# EAGLE design switches (EAGLE 4.16)
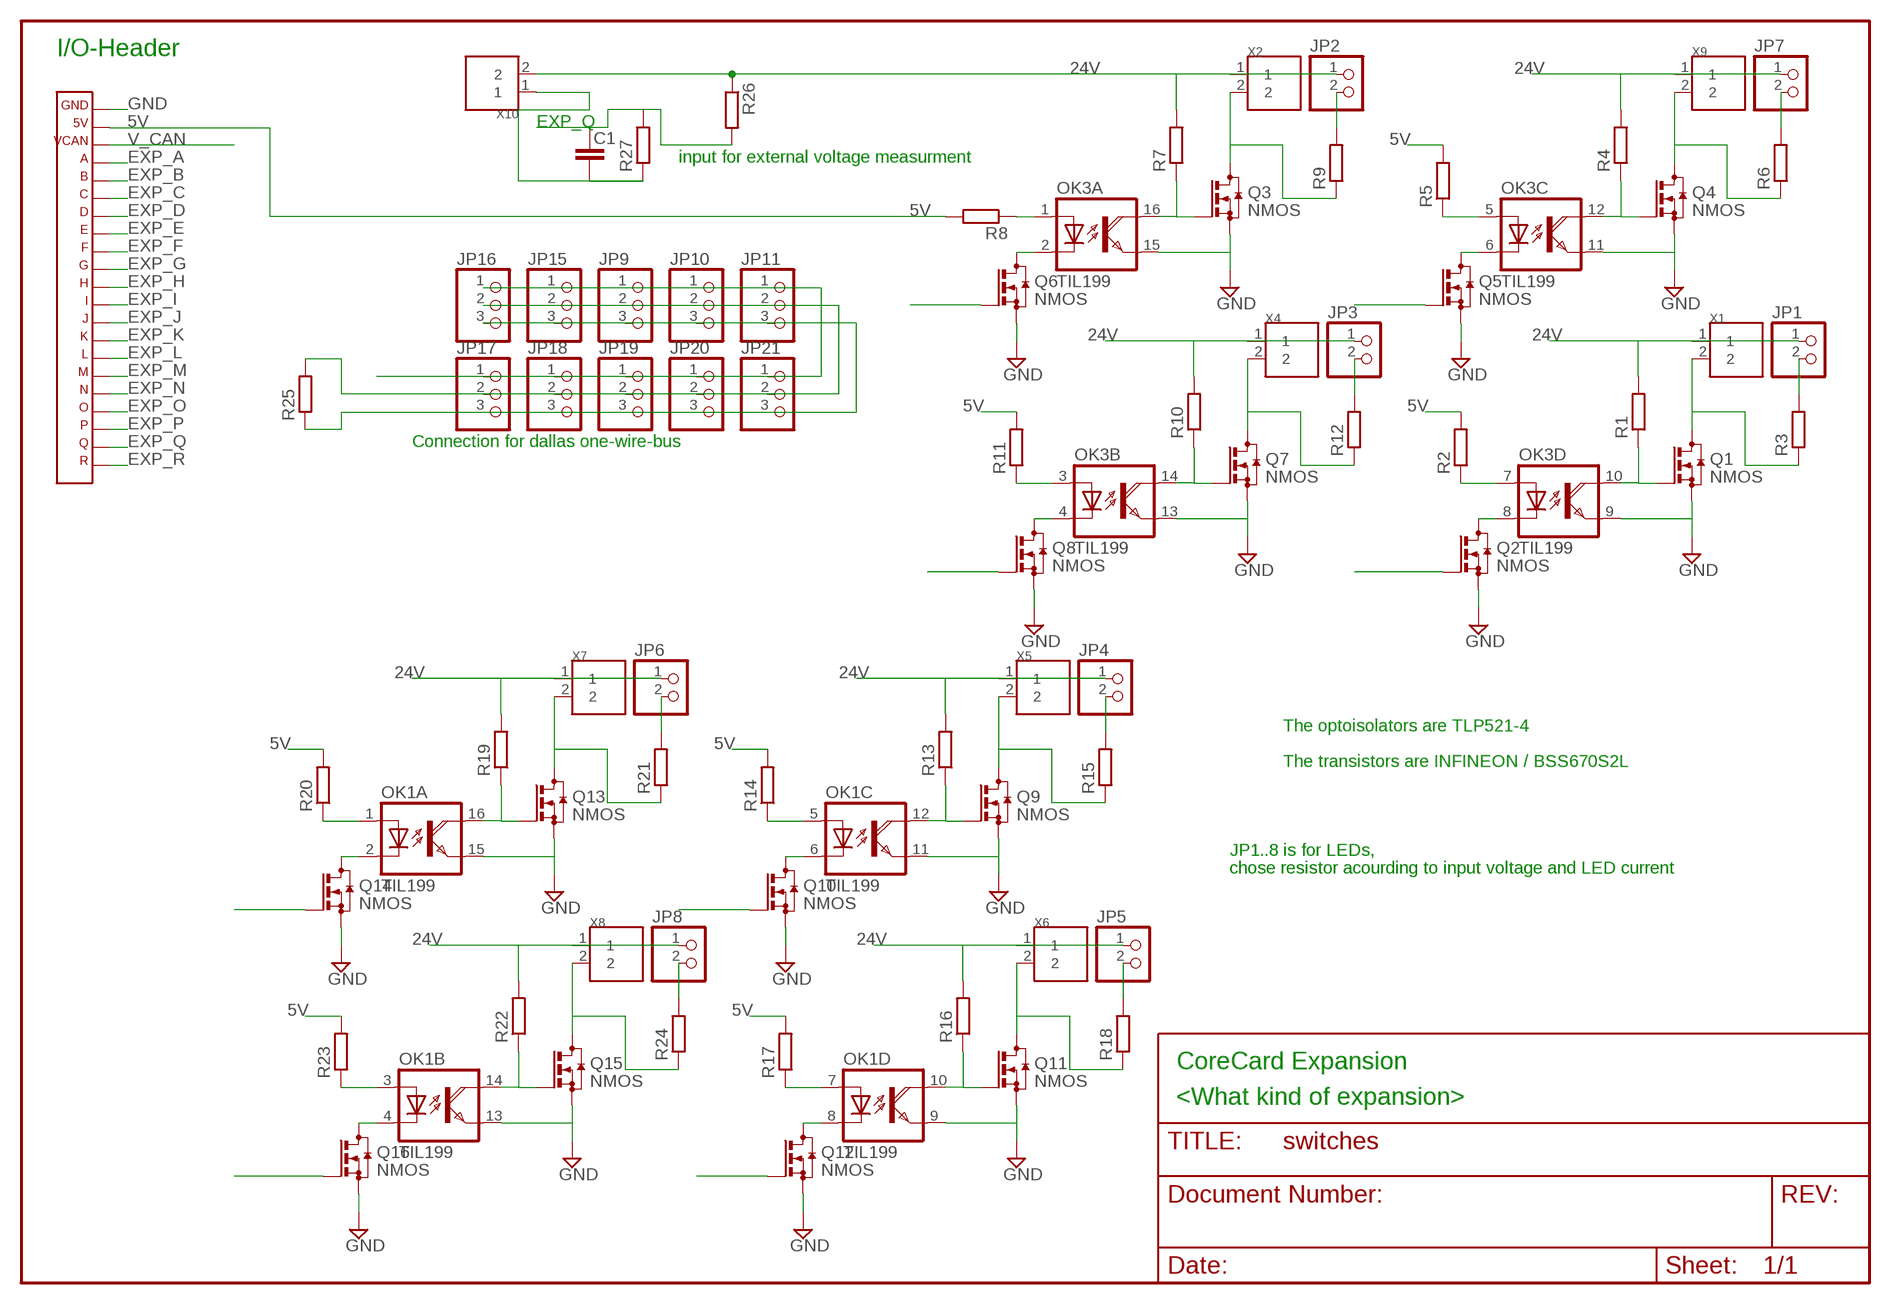
[diagram p0: schematic, sheet 1]

## Parts
C1  C-EUC0603  [C0603]
JP1  PINHD-1X2  [1X02]
JP2  PINHD-1X2  [1X02]
JP3  PINHD-1X2  [1X02]
JP4  PINHD-1X2  [1X02]
JP5  PINHD-1X2  [1X02]
JP6  PINHD-1X2  [1X02]
JP7  PINHD-1X2  [1X02]
JP8  PINHD-1X2  [1X02]
JP9  PINHD-1X3  [1X03]
JP10  PINHD-1X3  [1X03]
JP11  PINHD-1X3  [1X03]
JP15  PINHD-1X3  [1X03]
JP16  PINHD-1X3  [1X03]
JP17  PINHD-1X3  [1X03]
JP18  PINHD-1X3  [1X03]
JP19  PINHD-1X3  [1X03]
JP20  PINHD-1X3  [1X03]
JP21  PINHD-1X3  [1X03]
OK1  TIL199  [DIL16]
OK3  TIL199  [DIL16]
Q1  NMOS  [SOT23]
Q2  NMOS  [SOT23]
Q3  NMOS  [SOT23]
Q4  NMOS  [SOT23]
Q5  NMOS  [SOT23]
Q6  NMOS  [SOT23]
Q7  NMOS  [SOT23]
Q8  NMOS  [SOT23]
Q9  NMOS  [SOT23]
Q10  NMOS  [SOT23]
Q11  NMOS  [SOT23]
Q12  NMOS  [SOT23]
Q13  NMOS  [SOT23]
Q14  NMOS  [SOT23]
Q15  NMOS  [SOT23]
Q16  NMOS  [SOT23]
R1  R-EUR0603  [R0603@1]
R2  R-EUR0603  [R0603@1]
R3  R-EUR0603  [R0603@1]
R4  R-EUR0603  [R0603@1]
R5  R-EUR0603  [R0603@1]
R6  R-EUR0603  [R0603@1]
R7  R-EUR0603  [R0603@1]
R8  R-EUR0603  [R0603@1]
R9  R-EUR0603  [R0603@1]
R10  R-EUR0603  [R0603@1]
R11  R-EUR0603  [R0603@1]
R12  R-EUR0603  [R0603@1]
R13  R-EUR0603  [R0603@1]
R14  R-EUR0603  [R0603@1]
R15  R-EUR0603  [R0603@1]
R16  R-EUR0603  [R0603@1]
R17  R-EUR0603  [R0603@1]
R18  R-EUR0603  [R0603@1]
R19  R-EUR0603  [R0603@1]
R20  R-EUR0603  [R0603@1]
R21  R-EUR0603  [R0603@1]
R22  R-EUR0603  [R0603@1]
R23  R-EUR0603  [R0603@1]
R24  R-EUR0603  [R0603@1]
R25  R-EUR0603  [R0603@1]
R26  R-EUR0603  [R0603@1]
R27  R-EUR0603  [R0603@1]
X1  BLOCK2  [PCB2]
X2  BLOCK2  [PCB2]
X3  CORE_IOHEADEXP  [CORE_IOHEAD_NOSILC]
X4  BLOCK2  [PCB2]
X5  BLOCK2  [PCB2]
X6  BLOCK2  [PCB2]
X7  BLOCK2  [PCB2]
X8  BLOCK2  [PCB2]
X9  BLOCK2  [PCB2]
X10  BLOCK2  [PCB2]

## Nets
5V: JP9.3 JP10.3 JP15.3 JP16.3 JP18.3 JP19.3 JP20.3 JP21.3 R2.2 R5.2 R8.2 R11.2 R14.2 R17.2 R20.2 R23.2 R25.1 X3.2
24V: JP1.1 JP2.1 JP3.1 JP4.1 JP5.1 JP6.1 JP7.1 JP8.1 R1.2 R4.2 R7.2 R10.2 R13.2 R16.2 R19.2 R22.2 R26.1 X1.1 X2.1 X4.1 X5.1 X6.1 X7.1 X8.1 X9.1 X10.2
EXP_A: X3.4
EXP_B: X3.5
EXP_C: X3.6
EXP_D: X3.7
EXP_E: X3.8
EXP_F: JP9.2 JP10.2 JP11.2 JP15.2 JP16.2 JP17.2 JP18.2 JP19.2 JP20.2 JP21.2 R25.2 X3.9
EXP_G: X3.10
EXP_H: X3.11
EXP_I: Q14.1(G) X3.12
EXP_J: Q16.1(G) X3.13
EXP_K: Q10.1(G) X3.14
EXP_L: Q12.1(G) X3.15
EXP_M: Q6.1(G) X3.16
EXP_N: Q8.1(G) X3.17
EXP_O: Q5.1(G) X3.18
EXP_P: Q2.1(G) X3.19
EXP_Q: C1.1 R26.2 R27.2 X3.20
EXP_R: X3.21
GND: C1.2 JP9.1 JP10.1 JP11.1 JP15.1 JP16.1 JP17.1 JP18.1 JP19.1 JP20.1 JP21.1 OK1.9(D:EMI) OK1.11(C:EMI) OK1.13(B:EMI) OK1.15(A:EMI) OK3.9(D:EMI) OK3.11(C:EMI) OK3.13(B:EMI) OK3.15(A:EMI) Q1.2(S) Q2.2(S) Q3.2(S) Q4.2(S) Q5.2(S) Q6.2(S) Q7.2(S) Q8.2(S) Q9.2(S) Q10.2(S) Q11.2(S) Q12.2(S) Q13.2(S) Q14.2(S) Q15.2(S) Q16.2(S) R27.1 X3.1 X10.1
N$1: Q1.3(D) R3.1 X1.2
N$2: OK3.10(D:COL) Q1.1(G) R1.1
N$3: OK3.8(D:C) Q2.3(D)
N$4: OK3.7(D:A) R2.1
N$5: JP1.2 R3.2
N$6: Q3.3(D) R9.1 X2.2
N$7: OK3.16(A:COL) Q3.1(G) R7.1
N$8: OK3.2(A:C) Q6.3(D)
N$9: OK3.1(A:A) R8.1
N$10: JP2.2 R9.2
N$11: Q7.3(D) R12.1 X4.2
N$12: OK3.14(B:COL) Q7.1(G) R10.1
N$13: OK3.4(B:C) Q8.3(D)
N$14: OK3.3(B:A) R11.1
N$15: JP3.2 R12.2
N$16: Q9.3(D) R15.1 X5.2
N$17: OK1.12(C:COL) Q9.1(G) R13.1
N$18: Q4.3(D) R6.1 X9.2
N$19: OK3.12(C:COL) Q4.1(G) R4.1
N$20: OK3.6(C:C) Q5.3(D)
N$21: OK3.5(C:A) R5.1
N$22: JP7.2 R6.2
N$23: OK1.6(C:C) Q10.3(D)
N$24: OK1.5(C:A) R14.1
N$25: JP4.2 R15.2
N$26: Q11.3(D) R18.1 X6.2
N$27: OK1.10(D:COL) Q11.1(G) R16.1
N$28: OK1.8(D:C) Q12.3(D)
N$29: OK1.7(D:A) R17.1
N$30: JP5.2 R18.2
N$31: Q13.3(D) R21.1 X7.2
N$32: OK1.16(A:COL) Q13.1(G) R19.1
N$33: OK1.2(A:C) Q14.3(D)
N$34: OK1.1(A:A) R20.1
N$35: JP6.2 R21.2
N$36: Q15.3(D) R24.1 X8.2
N$37: OK1.14(B:COL) Q15.1(G) R22.1
N$38: OK1.4(B:C) Q16.3(D)
N$39: OK1.3(B:A) R23.1
N$40: JP8.2 R24.2
V_CAN: X3.3
Unconnected: JP11.3 JP17.3

## Notes on the sheet
- I/O-Header
- EXP_Q
- input for external voltage measurment
- Connection for dallas one-wire-bus
- The optoisolators are TLP521-4
- The transistors are INFINEON / BSS670S2L
- JP1..8 is for LEDs,
- chose resistor acourding to input voltage and LED current
- CoreCard Expansion
- <What kind of expansion>

## Library data of the parts
C1 = rcl:C-EU
JP1-JP8 = pinhead:PINHD-1X2: PIN HEADER
JP9-JP11 JP15-JP21 = pinhead:PINHD-1X3: PIN HEADER
OK1 OK3 = optocoupler:TIL199: TEXAS INSTRUMENTS OPTO COUPLER
Q1-Q16 = transistor:NMOS
R1-R27 = rcl:R-EU
X1 X2 X4-X10 = terminal_block_5mm:BLOCK2
X3 = expboard:CORE_IOHEAD: CoreCard IO-header for expansion cards

## Board
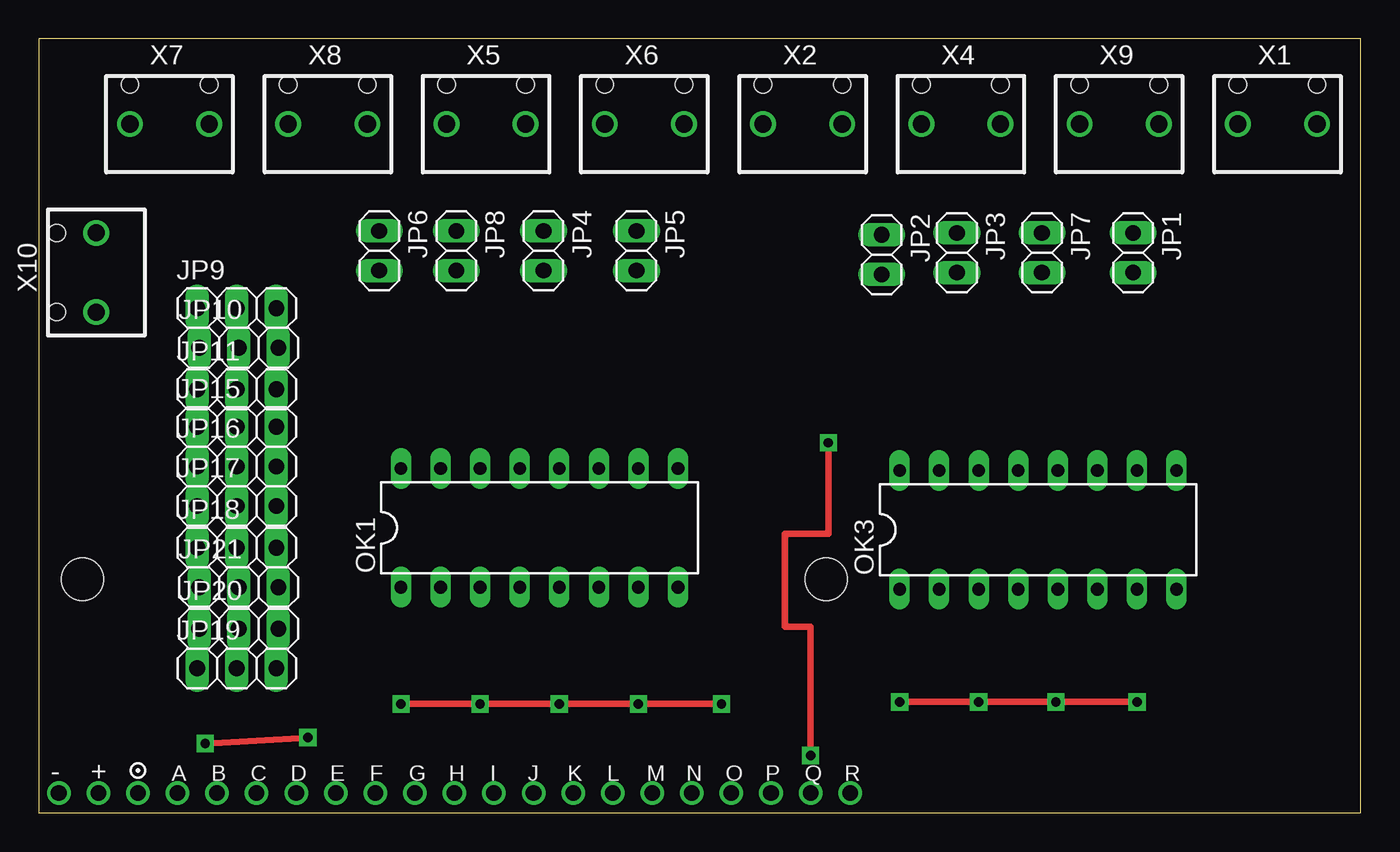
[diagram p1: board, top side]
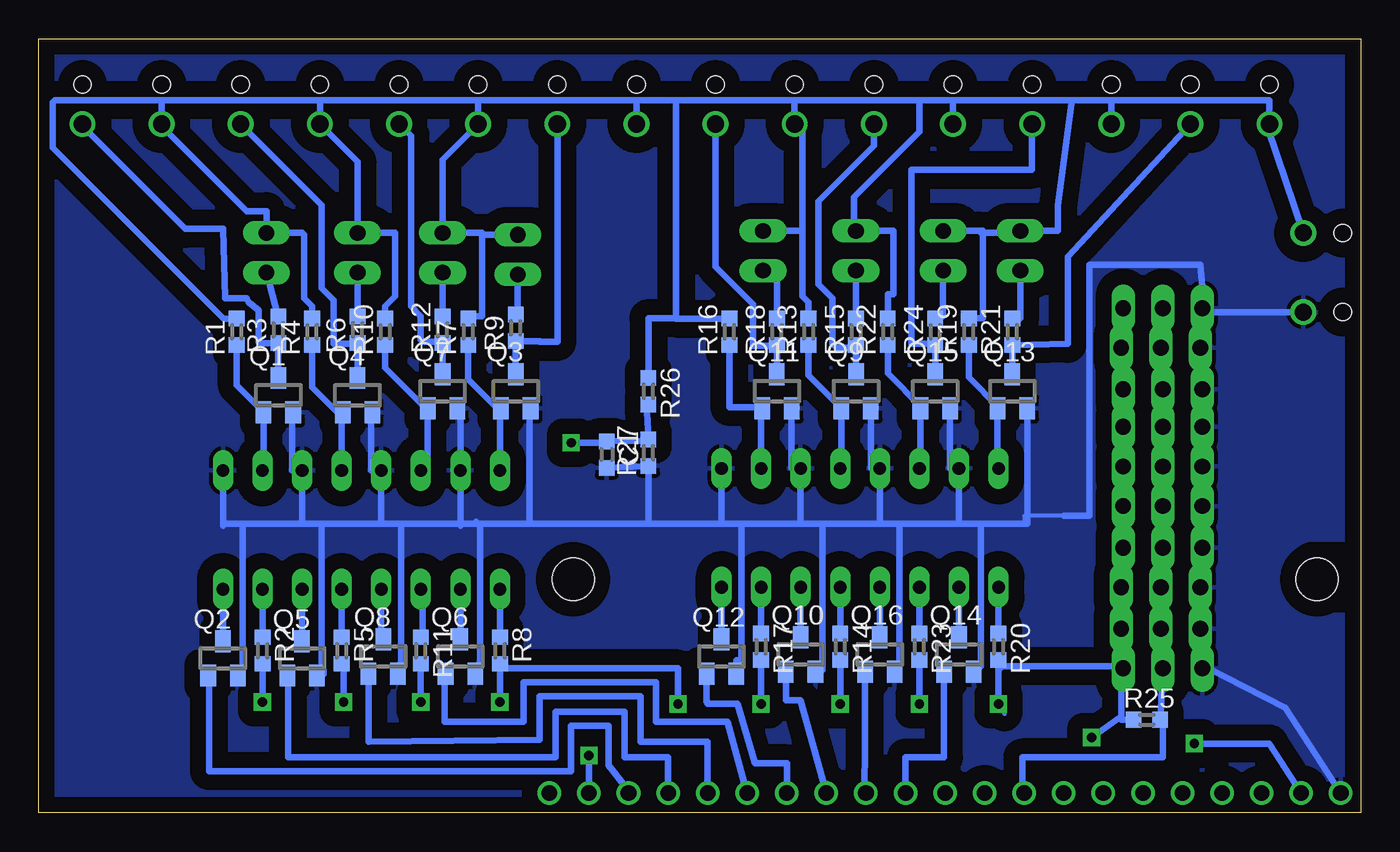
[diagram p2: board, bottom side, seen from below]

Size 84.84 x 49.66 mm. Coordinates in mm from the lower left corner, seen from the top.
Outline: 0,0 84.84,0 84.84,49.66 0,49.66 0,0
Copper layers (1*16): Top 0.035mm / dielectric 1.5mm / Bottom 0.035mm
Design rules "default": minimum track width 10mil, minimum drill 0.6mm, track to track 10mil, track to pad 10mil, pad to pad 10mil, via to via 10mil, smd to smd 8mil, copper to edge 10mil, drill to drill 8mil, minimum pad ring 10mil, minimum via ring 10mil, stop-mask expansion 4mil, vias tented up to drill 0mil, thermal gap 10mil
Holes 2.7 mm at 50.55,14.99 2.79,14.99

### Footprints (pad centres in the part's own frame; a part is rotated, then mirrored left to right if it is on the bottom)
C0603 = smd 1 x 1: 1 -0.85,0; 2 0.85,0
1X02 = drill 1.016 long: 1 -1.27,0; 2 1.27,0
1X03 = drill 1.016 long: 1 -2.54,0; 2 0,0; 3 2.54,0
DIL16 = drill 0.813 long: 1 -8.89,-3.81; 2 -6.35,-3.81; 3 -3.81,-3.81; 4 -1.27,-3.81; 5 1.27,-3.81; 6 3.81,-3.81; 7 6.35,-3.81; 8 8.89,-3.81; 9 8.89,3.81; 10 6.35,3.81; 11 3.81,3.81; 12 1.27,3.81; 13 -1.27,3.81; 14 -3.81,3.81; 15 -6.35,3.81; 16 -8.89,3.81
SOT23 = smd 1 x 1.4: 1 -0.95,-1.1; 2 0.95,-1.1; 3 0,1.1
R0603@1 = smd 0.991 x 1.016: 1 -0.85,0; 2 0.85,0
PCB2 = drill 1.1 round: 1 -5.08,0; 2 0,0 | hole 1.1: -5.08,2.54; 0,2.54
CORE_IOHEAD_NOSILC = drill 1 round: 1 25.4,0; 2 22.86,0; 3 20.32,0; 4 17.78,0; 5 15.24,0; 6 12.7,0; 7 10.16,0; 8 7.62,0; 9 5.08,0; 10 2.54,0; 11 0,0; 12 -2.54,0; 13 -5.08,0; 14 -7.62,0; 15 -10.16,0; 16 -12.7,0; 17 -15.24,0; 18 -17.78,0; 19 -20.32,0; 20 -22.86,0; 21 -25.4,0

### Placement (x,y rotation side)
C1  48.39,22.99 270 bottom
JP1  70.23,35.94 270 top
JP2  54.1,35.81 270 top
JP3  58.93,35.94 270 top
JP4  32.38,36.07 270 top
JP5  38.35,36.07 270 top
JP6  21.84,36.07 270 top
JP7  64.39,35.94 270 top
JP8  26.8,36.07 270 top
JP9  12.7,32.38 0 top
JP10  12.83,29.84 0 top
JP11  12.7,27.18 0 top
JP15  12.7,24.77 0 top
JP16  12.7,22.23 0 top
JP17  12.7,19.68 0 top
JP18  12.7,17.02 0 top
JP19  12.7,9.27 0 top
JP20  12.83,11.81 0 top
JP21  12.83,14.48 0 top
OK1  32.13,18.29 0 top
OK3  64.14,18.16 0 top
Q1  69.47,26.8 0 bottom
Q2  73.03,9.91 0 bottom
Q3  54.23,27.05 0 bottom
Q4  64.39,26.8 0 bottom
Q5  67.94,9.91 0 bottom
Q6  57.78,10.03 0 bottom
Q7  58.93,27.05 0 bottom
Q8  62.74,10.03 0 bottom
Q9  32.38,27.05 0 bottom
Q10  35.94,10.16 0 bottom
Q11  37.47,27.05 0 bottom
Q12  41.02,10.03 0 bottom
Q13  22.35,27.05 0 bottom
Q14  25.78,10.16 0 bottom
Q15  27.3,27.05 0 bottom
Q16  30.86,10.16 0 bottom
R1  72.14,30.86 90 bottom
R2  70.48,10.41 270 bottom
R3  69.47,30.99 90 bottom
R4  67.31,30.86 90 bottom
R5  65.41,10.41 270 bottom
R6  64.39,30.99 90 bottom
R7  57.28,30.86 90 bottom
R8  55.24,10.41 270 bottom
R9  54.23,31.11 90 bottom
R10  62.61,30.86 90 bottom
R11  60.33,10.41 270 bottom
R12  58.93,30.99 90 bottom
R13  35.43,30.86 90 bottom
R14  33.4,10.67 270 bottom
R15  32.38,30.86 90 bottom
R16  40.51,30.86 90 bottom
R17  38.48,10.67 270 bottom
R18  37.47,30.86 90 bottom
R19  25.15,30.86 90 bottom
R20  23.24,10.67 270 bottom
R21  22.35,30.86 90 bottom
R22  30.35,30.86 90 bottom
R23  28.32,10.67 270 bottom
R24  27.3,30.86 90 bottom
R25  13.72,5.97 0 bottom
R26  45.72,27.05 270 bottom
R27  45.72,23.11 90 bottom
X1  82.04,44.2 0 top
X2  51.56,44.2 0 top
X3  26.67,1.27 0 bottom
X4  61.72,44.2 0 top
X5  31.24,44.2 0 top
X6  41.4,44.2 0 top
X7  10.92,44.2 0 top
X8  21.08,44.2 0 top
X9  71.88,44.2 0 top
X10  3.68,37.21 90 top

### Tracks (layer width: path | path; a pad name or v marks a point on that pad's centre or on a via)
5V  (via drill 0.6)
  Top 0.406: v70.48,7.11 v65.28,7.11 v60.33,7.11 v55.24,7.11 | v43.81,6.99 v38.48,6.99 v33.4,6.99 28.45,6.99 | 28.45,6.99 v28.32,6.99 | v23.24,6.99 28.45,6.99 | v10.67,4.45 v17.27,4.83
  Bottom 0.254: v23.24,6.99 22.86,6.35
  Bottom 0.406: v70.48,7.11 R2.2 | R5.2 65.41,9.53 65.28,9.4 v65.28,7.11 | v60.33,7.11 R11.2 | R8.2 v55.24,7.11 55.24,9.27 43.81,9.27 v43.81,6.99 | v38.48,6.99 R17.2 | v33.4,6.99 R14.2 | v28.32,6.99 R23.2 | 23.24,9.27 v23.24,6.99 | 23.24,9.27 R20.2 | 15.37,9.27 15.37,9.4 | 15.37,9.27 JP19.3 | R25.1 15.37,5.97 15.37,6.1 | 15.37,6.1 15.37,9.27 | 23.24,9.27 23.11,9.27 23.11,9.4 15.37,9.4 | 15.24,11.81 15.24,11.94 | 15.37,9.4 15.24,9.4 15.24,11.81 | 15.24,11.81 JP20.3 | 15.24,11.81 15.24,14.48 | 15.24,14.48 JP21.3 | 15.24,14.48 JP18.3 15.24,19.68 | 15.24,19.68 15.24,19.81 | 15.24,19.68 JP16.3 15.11,22.23 15.11,24.64 | JP15.3 15.11,24.77 15.11,24.64 | 15.11,24.64 15.24,24.64 15.24,27.18 15.11,27.18 15.11,29.84 JP10.3 15.37,32.38 JP9.3 | X3.2 5.84,4.45 v10.67,4.45 | 15.37,6.1 15.49,6.1 v17.27,4.83
24V
  Bottom 0.406: R10.2 62.61,32.51 61.98,33.15 61.98,37.21 JP7.1 64.39,41.78 X9.1 66.8,45.72 | R4.2 67.31,32.51 67.82,33.02 67.82,37.08 67.94,37.21 JP1.1 70.23,38.61 71.5,38.61 77.09,44.2 X1.1 | R1.2 72.99,31.71 83.95,42.67 83.95,45.59 83.82,45.72 77.09,45.72 | 77.09,45.72 76.96,45.72 X1.1 | X1.1 76.96,43.94 | 66.8,45.72 77.09,45.72 | 56.64,45.72 X4.1 58.93,41.91 JP3.1 56.39,37.21 | 56.64,45.72 66.8,45.72 | R7.2 57.28,31.88 56.39,31.88 56.39,37.21 | 56.39,37.21 56.39,37.08 JP2.1 | 46.48,45.72 56.64,45.72 | R13.2 35.43,32.77 35.81,33.15 35.81,37.34 | 35.81,37.34 JP5.1 | 35.81,37.34 35.81,43.69 X6.1 36.32,45.72 | 46.48,45.72 X2.1 | 36.32,45.72 43.94,45.72 | 43.94,45.72 46.48,45.72 | X5.1 26.16,45.72 26.29,45.72 | 26.29,45.72 28.32,45.72 | 28.32,45.72 36.32,45.72 | X8.1 16,45.72 16.13,45.72 | 16.13,45.72 18.54,45.72 | 18.54,45.72 26.29,45.72 | 16.13,45.72 5.84,45.72 X7.1 5.97,43.94 X10.2 | R22.2 30.35,33.27 29.97,33.27 29.97,37.34 JP4.1 32.51,37.34 32.51,39.5 28.32,43.69 28.32,45.72 | R19.2 25.15,31.75 24.26,31.75 24.26,37.21 | 24.26,37.21 24.26,37.34 | 18.54,45.72 19.41,38.99 | 19.41,38.99 19.43,38.86 | R16.2 43.94,31.71 43.94,31.75 | 43.94,45.72 43.94,31.75 | 24.26,37.21 24.38,37.21 24.38,37.34 JP8.1 | 21.59,37.34 21.59,37.47 | 21.59,37.34 JP6.1 19.43,37.34 19.43,38.99 | 24.26,37.21 21.59,37.21 21.59,37.34 | 19.43,38.99 | 19.41,38.99 19.43,38.99 | R26.1 45.72,31.75 43.94,31.75
EXP_F
  Bottom 0.406: 21.72,1.27 21.72,1.14 | 21.72,1.27 X3.9 | 21.72,1.27 21.72,3.56 12.7,3.56 12.7,5.97 R25.2 JP19.2 12.7,11.94 JP20.2 JP21.2 12.83,17.14 JP18.2 12.57,19.68 JP17.2 JP16.2 | JP16.2 12.7,22.48 | JP16.2 12.83,24.89 JP15.2 12.83,27.3 JP11.2 12.57,29.84 JP10.2 12.57,32.51 JP9.2
EXP_I
  Bottom 0.406: Q14.1 26.73,3.56 29.21,3.56 X3.12 29.34,1.27
EXP_J
  Bottom 0.406: Q16.1 31.81,3.3 31.88,1.52 31.75,1.14 | X3.13 31.75,1.14 | 31.75,1.14 31.88,1.14
EXP_K
  Bottom 0.406: Q10.1 36.89,7.24 35.94,7.24 X3.14 34.42,1.27
EXP_L
  Bottom 0.406: Q12.1 41.97,7.11 41.91,7.11 41.91,6.99 40.01,6.99 38.86,3.17 36.83,3.17 X3.15 36.96,1.27
EXP_M
  Bottom 0.406: X3.16 40.64,5.84 45.21,5.84 45.21,8.38 53.72,8.38 53.72,5.84 58.8,5.84 58.8,8.89 | 58.8,8.89 58.73,8.89 Q6.1 | 58.8,8.89 58.93,8.89
EXP_N
  Bottom 0.406: Q8.1 63.69,4.57 52.7,4.7 52.7,7.49 46.23,7.49 46.23,4.57 41.91,4.57 41.91,1.4 | X3.17 41.91,1.4 | 41.91,1.4 41.78,1.4
EXP_O
  Bottom 0.406: Q5.1 68.83,8.81 68.83,3.56 51.69,3.56 51.69,6.48 47.24,6.48 47.24,3.56 44.45,3.56 X3.18 44.45,1.14
EXP_P
  Bottom 0.406: 46.86,1.27 46.86,1.14 | X3.19 46.86,1.27 | 73.91,8.81 Q2.1 73.97,8.64 73.91,8.64 73.91,2.67 50.67,2.67 50.67,5.59 48.26,5.59 48.26,3.05 46.86,1.27
EXP_Q  (via drill 0.6)
  Top 0.406: v49.53,3.68 49.53,11.94 47.88,11.94 47.88,17.91 50.67,17.91 v50.67,23.75
  Bottom 0.406: X3.20 v49.53,3.68 | v50.67,23.75 48.39,23.75 C1.1 45.85,23.88 R27.2 45.85,26.29 R26.2
GND
  Bottom 0.254: 19.05,19.05 21.59,19.05 21.59,18.54
  Bottom 0.406: Q6.2 56.84,9.33 56.52,9.65 56.52,18.54 56.77,18.54 | 56.77,18.54 57.66,18.54 57.78,18.41 57.78,18.54 | 57.78,18.54 OK3.15 57.78,25.95 Q7.2 | 61.59,18.54 61.59,9.65 61.79,9.46 Q8.2 61.59,8.93 61.59,18.54 | 61.59,18.54 62.87,18.54 OK3.13 63.5,21.97 63.5,25.7 Q4.2 | 57.78,18.54 61.59,18.54 | 66.67,18.54 67.94,18.54 OK3.11 68.58,21.97 68.58,25.7 Q1.2 | 66.55,9.14 66.55,8.89 66.8,8.89 66.8,8.81 Q5.2 66.67,8.81 66.67,18.54 | 61.59,18.54 66.67,18.54 | 66.67,18.54 71.75,18.54 | 71.75,18.54 73.03,18.54 | 73.03,18.54 73.03,18.41 | 73.03,18.54 OK3.9 | Q2.2 71.75,8.81 71.75,18.54 | Q3.2 53.34,25.95 53.34,18.54 53.47,18.54 | 53.47,18.54 56.77,18.54 | 56.77,18.54 56.77,18.67 | Q12.2 40.07,9.78 39.75,9.78 39.75,18.54 39.88,18.54 | 39.88,18.54 41.02,18.54 | 41.02,18.54 OK1.9 | 41.02,18.54 45.72,18.54 | 45.72,18.54 53.47,18.54 | Q16.2 29.91,9.53 29.59,9.53 29.59,18.54 | 29.59,18.54 30.86,18.54 | 30.86,18.54 34.67,18.54 | 34.67,18.54 35.94,18.54 | 35.94,18.54 39.88,18.54 | Q10.2 34.99,9.14 34.54,9.14 34.54,18.54 34.67,18.54 | Q14.2 24.83,9.4 24.38,9.4 24.38,18.54 | 24.38,18.54 25.78,18.54 | 25.78,18.54 29.59,18.54 | 35.94,18.54 OK1.11 36.52,22.1 Q11.2 | 30.86,18.54 OK1.13 31.43,22.1 Q9.2 | 25.78,18.54 OK1.15 | OK1.15 25.65,22.1 | Q15.2 26.36,22.1 OK1.15 | Q13.2 21.4,18.54 21.59,18.54 24.38,18.54 | 19.05,19.05 17.4,19.05 17.4,35.18 10.29,35.18 10.03,32.38 JP9.1 | 10.41,29.59 JP10.1 | 10.41,29.59 JP9.1 | 10.41,29.59 JP11.1 10.29,24.64 JP15.1 JP16.1 | JP16.1 10.16,21.97 | 10.41,19.43 JP17.1 10.54,16.38 10.54,16.51 10.03,14.48 JP21.1 JP20.1 | 10.41,19.43 JP16.1 | JP20.1 10.29,11.56 | JP20.1 10.16,9.14 JP19.1 10.03,9.4 4.83,6.73 X3.1
  Bottom 0.406: JP18.1 10.29,17.02 10.41,19.43 | JP9.1 9.91,32.13 X10.1 | 45.72,18.54 R27.1 45.85,22.23 C1.2
  pour Bottom (isolate 1.016, rank 3): 0,49.15 84.96,49.15 84.71,17.65 84.71,0.89 0,0.76 0,12.7 3.68,12.7 arc90 4.7,13.97 4.7,15.37 arc90 3.3,17.53 0,17.53
N$1
  Bottom 0.406: 69.47,27.81 Q1.3 R3.1 70.65,30.14 70.74,30.23 70.74,32.26 71.37,32.77 71.5,33.02 72.9,33.02 73.03,37.47 75.44,37.47 82.04,44.07 X1.2
N$2
  Bottom 0.406: 70.4,25.7 70.36,25.65 | 70.4,25.7 Q1.1 70.42,21.91 70.48,21.84 OK3.10 | R1.1 72.14,27.43 70.4,25.7
N$3
  Bottom 0.406: Q2.3 OK3.8
N$4
  Bottom 0.406: 70.48,11.18 R2.1 OK3.7
N$5
  Bottom 0.406: R3.2 JP1.2
N$6
  Bottom 0.406: Q3.3 R9.1 52.7,30.27 | 52.7,30.27 52.67,30.27 | 52.7,30.27 52.7,30.23 51.56,30.23 X2.2
N$7
  Bottom 0.406: OK3.16 55.24,26.16 55.18,26.1 Q3.1 55.41,25.95 57.28,27.81 R7.1 57.28,30.1
N$8
  Bottom 0.406: Q6.3 OK3.2
N$9
  Bottom 0.406: R8.1 OK3.1
N$10
  Bottom 0.406: R9.2 54.23,32 54.1,32.13 JP2.2
N$11
  Bottom 0.406: 58.93,28.07 Q7.3 58.93,30.1 | R12.1 58.93,30.1 | 58.93,30.1 59.05,30.23 60.2,30.23 60.33,30.35 60.33,31.88 60.96,32.51 60.96,43.43 X4.2
N$12
  Bottom 0.406: R10.1 62.61,28.57 59.94,25.91 59.9,25.95 Q7.1 59.88,22.67 60.45,22.1 OK3.14
N$13
  Bottom 0.406: Q8.3 62.87,11.13 OK3.4
N$14
  Bottom 0.406: 60.2,11.26 60.2,11.18 | R11.1 60.2,11.26 | OK3.3 60.2,14.35 60.2,11.26
N$15
  Bottom 0.406: 58.93,31.75 R12.2 JP3.2
N$16
  Bottom 0.406: 32.38,29.97 Q9.3 | X5.2 31.24,42.8 34.8,39.24 34.8,33.91 33.91,33.02 33.91,30.1 33.66,29.84 32.51,29.84 32.38,29.97 | R15.1 32.38,29.97
N$17
  Bottom 0.406: 33.34,21.97 33.4,21.97 OK1.12 | 33.34,21.97 Q9.1 33.32,25.95 | 33.34,21.97 33.27,21.97 | 33.32,25.95 33.27,25.91 | R13.1 35.43,28.07 33.32,25.95
N$18
  Bottom 0.406: Q4.3 R6.1 64.43,30.14 64.52,30.23 64.64,30.1 65.91,30.1 65.91,32.89 66.67,33.66 66.67,38.99 X9.2
N$19
  Bottom 0.406: OK3.12 65.41,25.78 65.34,25.71 Q4.1 65.7,25.7 67.31,27.3 67.31,29.84 67.44,29.97 67.4,30.01 R4.1
N$20
  Bottom 0.406: 67.94,10.92 Q5.3 OK3.6
N$21
  Bottom 0.406: 65.41,11.18 R5.1 OK3.5
N$22
  Bottom 0.406: R6.2 64.48,31.84 64.52,31.88 64.39,32 JP7.2
N$23
  Bottom 0.406: Q10.3 OK1.6
N$24
  Bottom 0.406: R14.1 OK1.5
N$25
  Bottom 0.406: R15.2 JP4.2
N$26
  Bottom 0.406: 37.47,29.97 Q11.3 | 37.47,29.97 37.34,29.97 | X6.2 41.4,35.05 38.99,32.64 38.99,29.97 37.47,29.97 | R18.1 37.47,29.97
N$27
  Bottom 0.406: 38.41,26.04 38.35,26.04 | 38.41,26.04 Q11.1 | OK1.10 38.48,26.04 | 38.48,26.04 38.41,26.04 | 38.48,26.04 40.51,26.04 R16.1 40.51,30.1
N$28
  Bottom 0.406: 41.02,14.35 OK1.8 | Q12.3 41.02,14.35 | 41.02,14.35 41.15,14.35
N$29
  Bottom 0.406: 38.48,11.43 R17.1 OK1.7
N$30
  Bottom 0.406: JP5.2 37.47,34.8 R18.2 37.47,31.62
N$31
  Bottom 0.406: Q13.3 R21.1 18.8,30.1 18.8,35.69 X7.2
N$32
  Bottom 0.406: OK1.16 23.24,21.97 23.3,21.97 Q13.1 23.3,25.97 23.24,26.04 25.15,27.94 R19.1
N$33
  Bottom 0.406: Q14.3 OK1.2
N$34
  Bottom 0.406: 23.24,11.43 R20.1 OK1.1
N$35
  Bottom 0.406: R21.2 22.35,31.75 21.84,31.75 JP6.2
N$36
  Bottom 0.406: 27.3,29.97 R24.1 27.3,30.1 28.83,30.1 28.83,41.27 21.08,41.27 X8.2 | 27.3,29.97 Q15.3 | 27.3,29.97 27.43,29.97
N$37
  Bottom 0.406: OK1.14 28.25,22.1 Q15.1 28.25,25.97 28.19,26.04 30.35,28.19 R22.1
N$38
  Bottom 0.406: Q16.3 OK1.4
N$39
  Bottom 0.406: 28.32,11.43 R23.1 OK1.3
N$40
  Bottom 0.406: R24.2 27.3,31.88 26.8,31.88 JP8.2

### Text on the board
tPlace: - | + | A | B | C | D | E | F | G | H | I | J | K | L | M | N | O | P | Q | R
Document: Top is component side | Expansion will be mounted bottom to bottom with CoreCard | Change vertical dimension to fit | Remove I/O-header silcscreen if neccesary | Remove mounting holes if neccesary